# Altium schematic sheet mpc56_cpuio2.SchDoc: CPU I/O Bank 2
size Letter; Organization: NewAE Technology Inc.; Address1: 1083 Queen St., Suite 196; Address2: Halifax; Address3: NS; Address4: Canada B3H 0B2; SheetNumber: 3; SheetTotal: 5; SheetApproved: NO
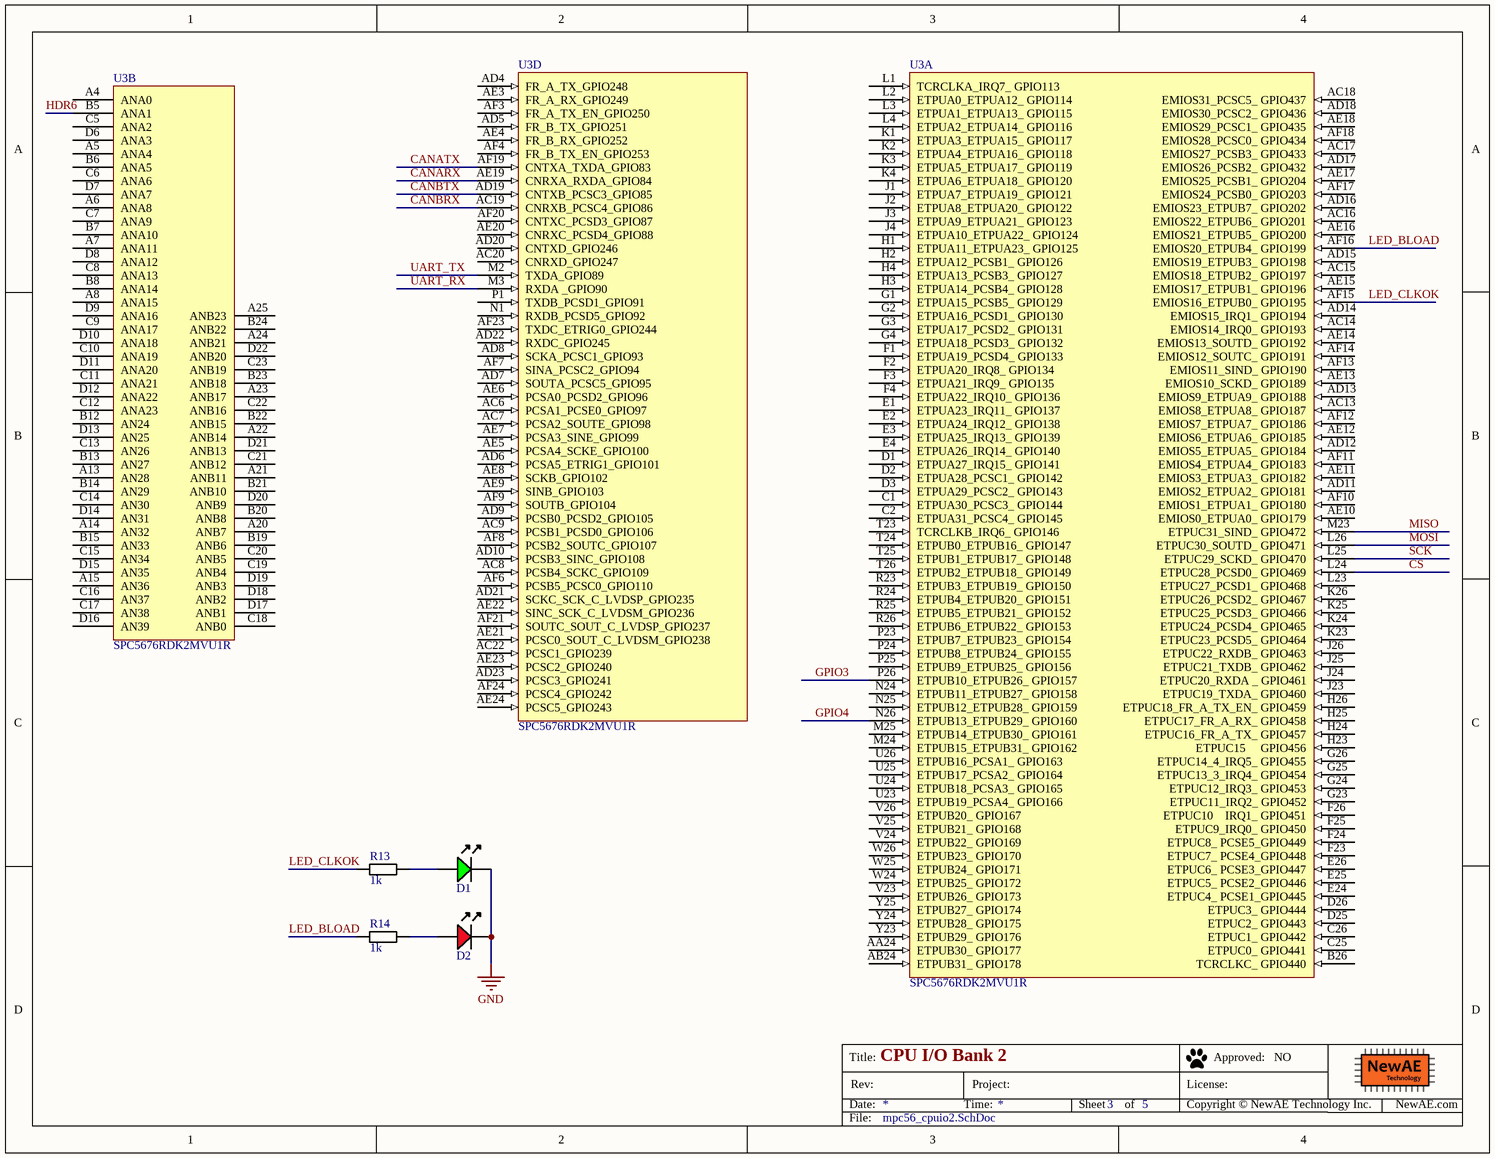
[diagram p0: mpc56_cpuio2.SchDoc]

## Parts
D1  LED, 0603, Green  [LED-0603-GREEN]  (value not drawn)
D2  LED, 0603, Red  [LED-0603-RED]  (value not drawn)
R13  1k  [RESC1608X55N]
R14  1k  [RESC1608X55N]
U3  SPC5676RDK2MVU1R  [TEPBGA416_27x27]  (parts A,B,D of 6)

## Nets
GND: D1.K D2.K
CANARX: U3.AE19(CNRXA_RXDA_GPIO84)
CANATX: U3.AF19(CNTXA_TXDA_GPIO83)
CANBRX: U3.AC19(CNRXB_PCSC4_GPIO86)
CANBTX: U3.AD19(CNTXB_PCSC3_GPIO85)
CS: U3.L24(ETPUC28_PCSD0__GPIO469)
GPIO3: U3.P26(ETPUB10_ETPUB26__GPIO157)
GPIO4: U3.N26(ETPUB13_ETPUB29__GPIO160)
HDR6: U3.B5(ANA1)
LED_BLOAD: R14.1 U3.AF16(EMIOS20_ETPUB4__GPIO199)
LED_CLKOK: R13.1 U3.AF15(EMIOS16_ETPUB0__GPIO195)
MISO: U3.M23(ETPUC31_SIND__GPIO472)
MOSI: U3.L26(ETPUC30_SOUTD__GPIO471)
SCK: U3.L25(ETPUC29_SCKD__GPIO470)
UART_RX: U3.M3(RXDA__GPIO90)
UART_TX: U3.M2(TXDA_GPIO89)
NetD1_A: D1.A R13.2
NetD2_A: D2.A R14.2

Not connected (* = marked no-connect by the designer): U3 A4(ANA0) A5(ANA4) A6(ANA8) A7(ANA11) A8(ANA15) A13(AN28) A14(AN32) A15(AN36) A20(ANB7) A21(ANB11) A22(ANB14) A23(ANB17) A24(ANB21) A25(ANB23) AA24(ETPUB30__GPIO177) AB24(ETPUB31__GPIO178) AC6(PCSA1_PCSE0_GPIO97) AC7(PCSA2_SOUTE_GPIO98) AC8(PCSB4_SCKC_GPIO109) AC9(PCSB1_PCSD0_GPIO106) AC13(EMIOS8_ETPUA8__GPIO187) AC14(EMIOS14_IRQ0__GPIO193) AC15(EMIOS18_ETPUB2__GPIO197) AC16(EMIOS22_ETPUB6__GPIO201) AC17(EMIOS27_PCSB3__GPIO433) AC18(EMIOS31_PCSC5__GPIO437) AC20(CNRXD_GPIO247) AC22(PCSC1_GPIO239) AD4(FR_A_TX_GPIO248) AD5(FR_B_TX_GPIO251) AD6(PCSA5_ETRIG1_GPIO101) AD7(SOUTA_PCSC5_GPIO95) AD8(SCKA_PCSC1_GPIO93) AD9(PCSB0_PCSD2_GPIO105) AD10(PCSB3_SINC_GPIO108) AD11(EMIOS2_ETPUA2__GPIO181) AD12(EMIOS5_ETPUA5__GPIO184) AD13(EMIOS9_ETPUA9__GPIO188) AD14(EMIOS15_IRQ1__GPIO194) AD15(EMIOS19_ETPUB3__GPIO198) AD16(EMIOS23_ETPUB7__GPIO202) AD17(EMIOS26_PCSB2__GPIO432) AD18(EMIOS30_PCSC2__GPIO436) AD20(CNTXD_GPIO246) AD21(SCKC_SCK_C_LVDSP_GPIO235) AD22(RXDC_GPIO245) AD23(PCSC3_GPIO241) AE3(FR_A_RX_GPIO249) AE4(FR_B_RX_GPIO252) AE5(PCSA4_SCKE_GPIO100) AE6(PCSA0_PCSD2_GPIO96) AE7(PCSA3_SINE_GPIO99) AE8(SCKB_GPIO102) AE9(SINB_GPIO103) AE10(EMIOS0_ETPUA0__GPIO179) AE11(EMIOS3_ETPUA3__GPIO182) AE12(EMIOS6_ETPUA6__GPIO185) AE13(EMIOS10_SCKD__GPIO189) AE14(EMIOS13_SOUTD__GPIO192) AE15(EMIOS17_ETPUB1__GPIO196) AE16(EMIOS21_ETPUB5__GPIO200) AE17(EMIOS25_PCSB1__GPIO204) AE18(EMIOS29_PCSC1__GPIO435) AE20(CNRXC_PCSD4_GPIO88) AE21(PCSC0_SOUT_C_LVDSM_GPIO238) AE22(SINC_SCK_C_LVDSM_GPIO236) AE23(PCSC2_GPIO240) AE24(PCSC5_GPIO243) AF3(FR_A_TX_EN_GPIO250) AF4(FR_B_TX_EN_GPIO253) AF6(PCSB5_PCSC0_GPIO110) AF7(SINA_PCSC2_GPIO94) AF8(PCSB2_SOUTC_GPIO107) AF9(SOUTB_GPIO104) AF10(EMIOS1_ETPUA1__GPIO180) AF11(EMIOS4_ETPUA4__GPIO183) AF12(EMIOS7_ETPUA7__GPIO186) AF13(EMIOS11_SIND__GPIO190) AF14(EMIOS12_SOUTC__GPIO191) AF17(EMIOS24_PCSB0__GPIO203) AF18(EMIOS28_PCSC0__GPIO434) AF20(CNTXC_PCSD3_GPIO87) AF21(SOUTC_SOUT_C_LVDSP_GPIO237) AF23(TXDC_ETRIG0_GPIO244) AF24(PCSC4_GPIO242) B6(ANA5) B7(ANA10) B8(ANA14) B12(AN24) B13(AN27) B14(AN29) B15(AN33) B19(ANB6) B20(ANB8) B21(ANB10) B22(ANB15) B23(ANB18) B24(ANB22) B26(TCRCLKC__GPIO440) C1(ETPUA30_PCSC3__GPIO144) C2(ETPUA31_PCSC4__GPIO145) C5(ANA2) C6(ANA6) C7(ANA9) C8(ANA13) C9(ANA17) C10(ANA19) C11(ANA21) C12(ANA23) C13(AN26) C14(AN30) C15(AN34) C16(AN37) C17(AN38) C18(ANB0) C19(ANB4) C20(ANB5) C21(ANB12) C22(ANB16) C23(ANB19) C25(ETPUC0__GPIO441) C26(ETPUC1__GPIO442) D1(ETPUA27_IRQ15__GPIO141) D2(ETPUA28_PCSC1__GPIO142) D3(ETPUA29_PCSC2__GPIO143) D6(ANA3) D7(ANA7) D8(ANA12) D9(ANA16) D10(ANA18) D11(ANA20) D12(ANA22) D13(AN25) D14(AN31) D15(AN35) D16(AN39) D17(ANB1) D18(ANB2) D19(ANB3) D20(ANB9) D21(ANB13) D22(ANB20) D25(ETPUC2__GPIO443) D26(ETPUC3__GPIO444) E1(ETPUA23_IRQ11__GPIO137) E2(ETPUA24_IRQ12__GPIO138) E3(ETPUA25_IRQ13__GPIO139) E4(ETPUA26_IRQ14__GPIO140) E24(ETPUC4__PCSE1_GPIO445) E25(ETPUC5__PCSE2_GPIO446) E26(ETPUC6__PCSE3_GPIO447) F1(ETPUA19_PCSD4__GPIO133) F2(ETPUA20_IRQ8__GPIO134) F3(ETPUA21_IRQ9__GPIO135) F4(ETPUA22_IRQ10__GPIO136) F23(ETPUC7__PCSE4_GPIO448) F24(ETPUC8__PCSE5_GPIO449) F25(ETPUC9_IRQ0__GPIO450) F26(ETPUC10    IRQ1__GPIO451) G1(ETPUA15_PCSB5__GPIO129) G2(ETPUA16_PCSD1__GPIO130) G3(ETPUA17_PCSD2__GPIO131) G4(ETPUA18_PCSD3__GPIO132) G23(ETPUC11_IRQ2__GPIO452) G24(ETPUC12_IRQ3__GPIO453) G25(ETPUC13_3_IRQ4__GPIO454) G26(ETPUC14_4_IRQ5__GPIO455) H1(ETPUA11_ETPUA23__GPIO125) H2(ETPUA12_PCSB1__GPIO126) H3(ETPUA14_PCSB4__GPIO128) H4(ETPUA13_PCSB3__GPIO127) H23(ETPUC15    _GPIO456) H24(ETPUC16_FR_A_TX__GPIO457) H25(ETPUC17_FR_A_RX__GPIO458) H26(ETPUC18_FR_A_TX_EN__GPIO459) J1(ETPUA7_ETPUA19__GPIO121) J2(ETPUA8_ETPUA20__GPIO122) J3(ETPUA9_ETPUA21__GPIO123) J4(ETPUA10_ETPUA22__GPIO124) J23(ETPUC19_TXDA__GPIO460) J24(ETPUC20_RXDA___GPIO461) J25(ETPUC21_TXDB__GPIO462) J26(ETPUC22_RXDB__GPIO463) K1(ETPUA3_ETPUA15__GPIO117) K2(ETPUA4_ETPUA16__GPIO118) K3(ETPUA5_ETPUA17__GPIO119) K4(ETPUA6_ETPUA18__GPIO120) K23(ETPUC23_PCSD5__GPIO464) K24(ETPUC24_PCSD4__GPIO465) K25(ETPUC25_PCSD3__GPIO466) K26(ETPUC26_PCSD2__GPIO467) L1(TCRCLKA_IRQ7__GPIO113) L2(ETPUA0_ETPUA12__GPIO114) L3(ETPUA1_ETPUA13__GPIO115) L4(ETPUA2_ETPUA14__GPIO116) L23(ETPUC27_PCSD1__GPIO468) M24(ETPUB15_ETPUB31__GPIO162) M25(ETPUB14_ETPUB30__GPIO161) N1(RXDB_PCSD5_GPIO92) N24(ETPUB11_ETPUB27__GPIO158) N25(ETPUB12_ETPUB28__GPIO159) P1(TXDB_PCSD1_GPIO91) P23(ETPUB7_ETPUB23__GPIO154) P24(ETPUB8_ETPUB24__GPIO155) P25(ETPUB9_ETPUB25__GPIO156) R23(ETPUB3_ETPUB19__GPIO150) R24(ETPUB4_ETPUB20__GPIO151) R25(ETPUB5_ETPUB21__GPIO152) R26(ETPUB6_ETPUB22__GPIO153) T23(TCRCLKB_IRQ6__GPIO146) T24(ETPUB0_ETPUB16__GPIO147) T25(ETPUB1_ETPUB17__GPIO148) T26(ETPUB2_ETPUB18__GPIO149) U23(ETPUB19_PCSA4__GPIO166) U24(ETPUB18_PCSA3__GPIO165) U25(ETPUB17_PCSA2__GPIO164) U26(ETPUB16_PCSA1__GPIO163) V23(ETPUB26__GPIO173) V24(ETPUB22__GPIO169) V25(ETPUB21__GPIO168) V26(ETPUB20__GPIO167) W24(ETPUB25__GPIO172) W25(ETPUB24__GPIO171) W26(ETPUB23__GPIO170) Y23(ETPUB29__GPIO176) Y24(ETPUB28__GPIO175) Y25(ETPUB27__GPIO174)

## Notes on the sheet
- Title:
- Date:
- Rev:
- Time:
- Project:
- Sheet
- of
- License:
- Copyright © NewAE Technology Inc.
- Approved:
- NewAE.com
- File:

## Library data of the parts
D1 = LEDCHIP_0603_GREEN: Chip LED, Green; Part Number: LEDCHIP_0603_GREEN; Component Kind: Standard; Component Type: Standard; Pin Count: 2; Mounting Technology: SMT
D2 = LEDCHIP_0603_RED: Chip LED, Red; Part Number: LEDCHIP_0603_RED; Component Kind: Standard; Component Type: Standard; Pin Count: 2; Mounting Technology: SMT
R13 R14 = RCHIP-1K-0603: 1k res, 0603, 1%, 1/10W; Manufacture 1: Yageo; Manufacture Part Number 1: RC0603FR-071KL; Case-EIA: 0603; Case-Metric: 1608; Rated Power: 0.1W; Rated Voltage: 75VDC; Part Number: RCHIP-1K-0603; Component Kind: Standard; Component Type: Standard; Footprint: 0603; Pin Count: 2; Supplier 1: Digi-Key; Supplier Part Number 1: 311-1.00KHRCT-ND; Value: 1k; Tolerance: 1%; Mounting Technology: SMT; Temperature Range: -55C to 155C
U3 = SPC5676RDK2MVU1R: Dual-Core PPC, Automotive; Manufacture 1: NXP; Component Group: Digital IC; PP Material Stack: 0; Part Number: SPC5676RDK2MVU1R; Manufacture Part Number 1: SPC5676RDK2MVU1R; Pin Count: 412; Supplier 1: Mouser; Mounting Technology: SMT; RoHS: Yes; Component Kind: Standard; Component Type: Standard; PP Rotation: 0